# EAGLE design Pico_LED_Matrix_A1 (EAGLE 9.0.1)
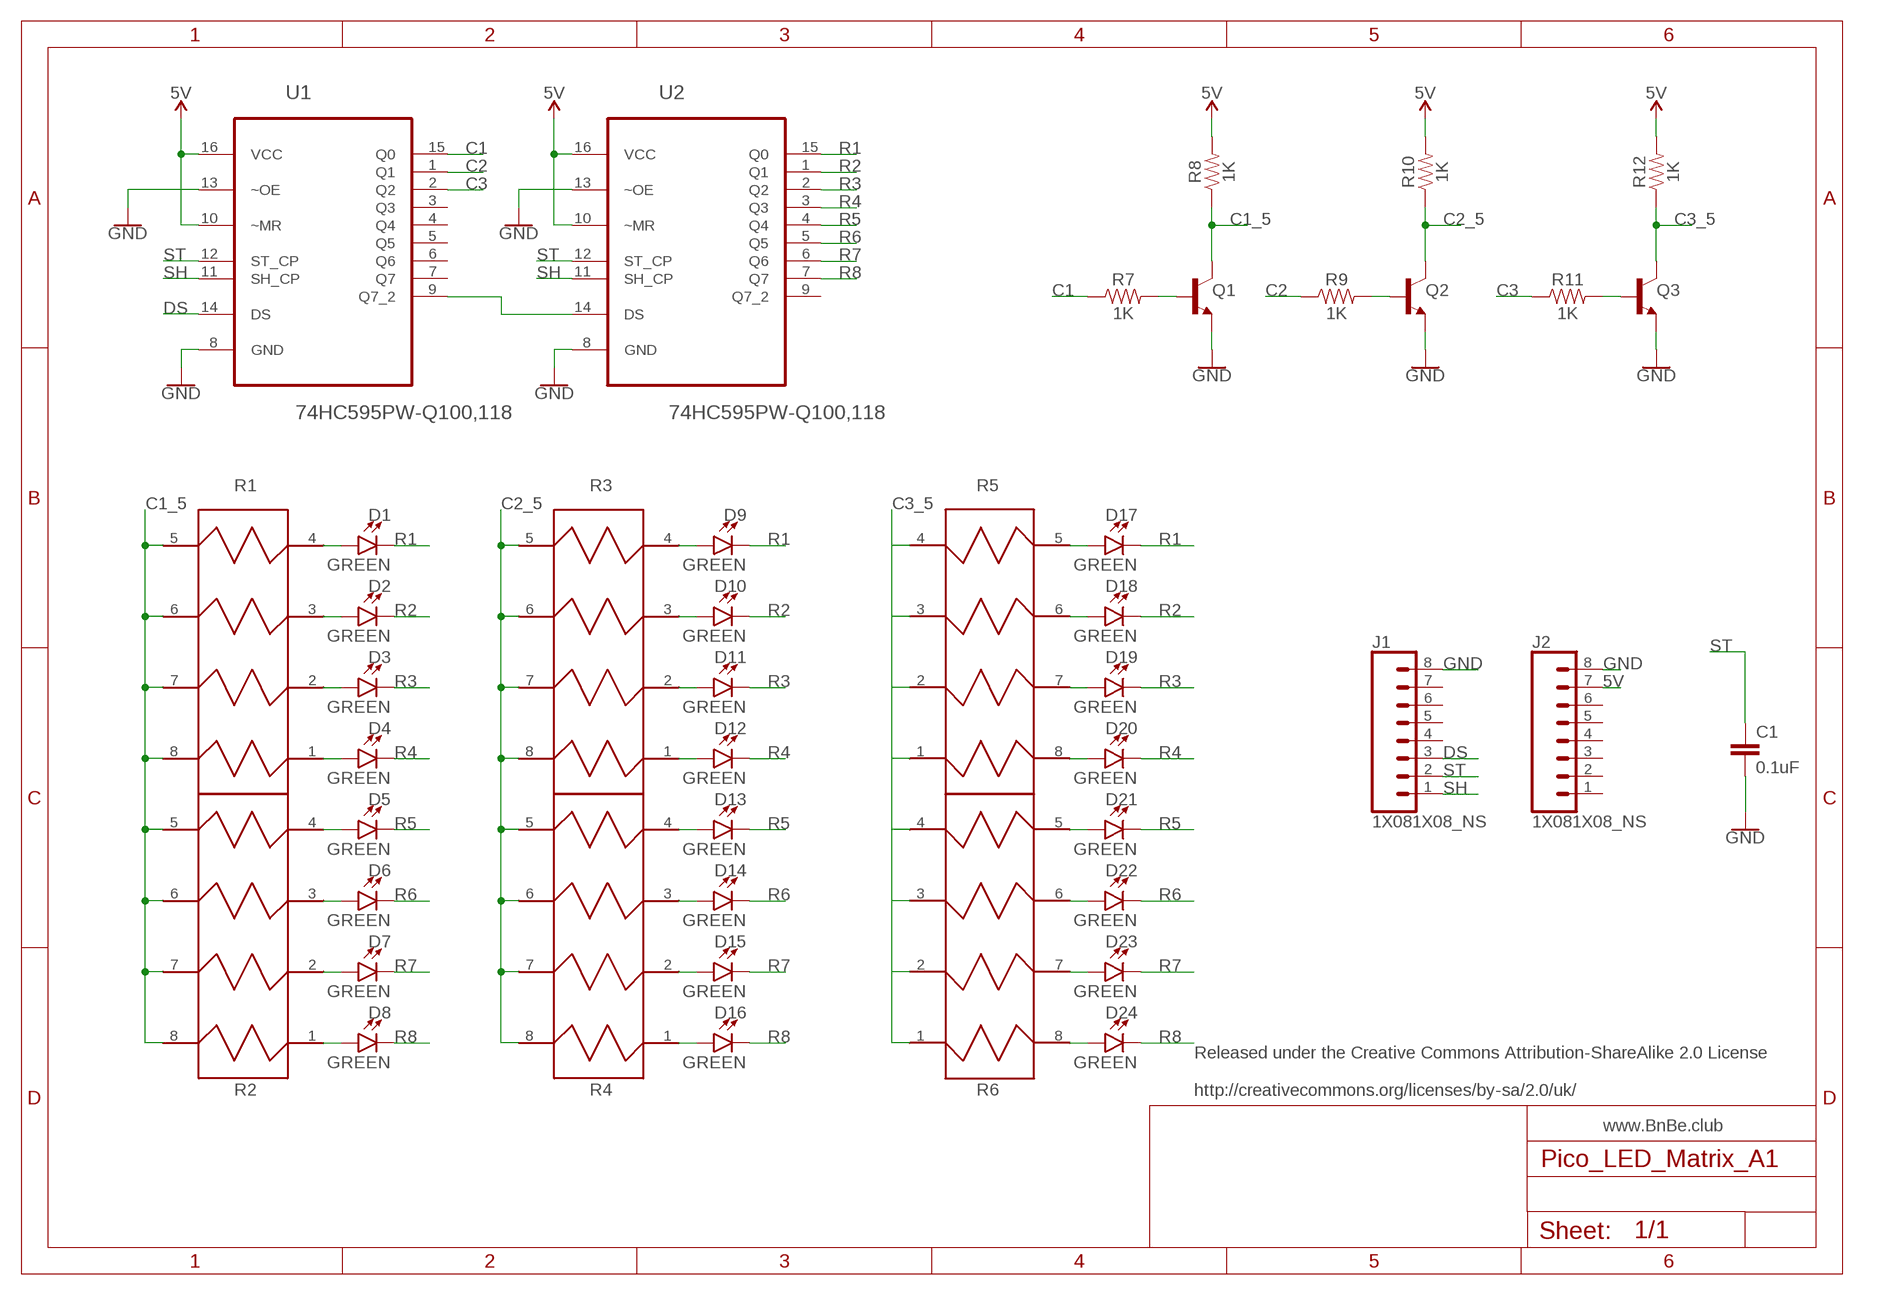
[diagram p0: schematic, sheet 1]

## Parts
C1  0.1uF  0.1UF-0402-16V-10%  [0402]
D1  GREEN  LED-GREEN0603  [LED-0603]
D2  GREEN  LED-GREEN0603  [LED-0603]
D3  GREEN  LED-GREEN0603  [LED-0603]
D4  GREEN  LED-GREEN0603  [LED-0603]
D5  GREEN  LED-GREEN0603  [LED-0603]
D6  GREEN  LED-GREEN0603  [LED-0603]
D7  GREEN  LED-GREEN0603  [LED-0603]
D8  GREEN  LED-GREEN0603  [LED-0603]
D9  GREEN  LED-GREEN0603  [LED-0603]
D10  GREEN  LED-GREEN0603  [LED-0603]
D11  GREEN  LED-GREEN0603  [LED-0603]
D12  GREEN  LED-GREEN0603  [LED-0603]
D13  GREEN  LED-GREEN0603  [LED-0603]
D14  GREEN  LED-GREEN0603  [LED-0603]
D15  GREEN  LED-GREEN0603  [LED-0603]
D16  GREEN  LED-GREEN0603  [LED-0603]
D17  GREEN  LED-GREEN0603  [LED-0603]
D18  GREEN  LED-GREEN0603  [LED-0603]
D19  GREEN  LED-GREEN0603  [LED-0603]
D20  GREEN  LED-GREEN0603  [LED-0603]
D21  GREEN  LED-GREEN0603  [LED-0603]
D22  GREEN  LED-GREEN0603  [LED-0603]
D23  GREEN  LED-GREEN0603  [LED-0603]
D24  GREEN  LED-GREEN0603  [LED-0603]
J1  1X081X08_NS  [1X08_NS]
J2  1X081X08_NS  [1X08_NS]
Q1  TRANS_NPN-MMBT2222AL  [SOT23-3]
Q2  TRANS_NPN-MMBT2222AL  [SOT23-3]
Q3  TRANS_NPN-MMBT2222AL  [SOT23-3]
R1  EXBN8V220JX  [RESCAV50P200X100X55-8N]
R2  EXBN8V220JX  [RESCAV50P200X100X55-8N]
R3  EXBN8V220JX  [RESCAV50P200X100X55-8N]
R4  EXBN8V220JX  [RESCAV50P200X100X55-8N]
R5  EXBN8V220JX  [RESCAV50P200X100X55-8N]
R6  EXBN8V220JX  [RESCAV50P200X100X55-8N]
R7  1K  RESISTOR0402  [0402]
R8  1K  RESISTOR0402  [0402]
R9  1K  RESISTOR0402  [0402]
R10  1K  RESISTOR0402  [0402]
R11  1K  RESISTOR0402  [0402]
R12  1K  RESISTOR0402  [0402]
U1  74HC595PW-Q100,118  [SOP65P640X110-16N]
U2  74HC595PW-Q100,118  [SOP65P640X110-16N]

## Nets
5V: J2.7 R8.2 R10.2 R12.2 U1.10(~MR) U1.16(VCC) U2.10(~MR) U2.16(VCC)
C1: R7.1 U1.15(Q0)
C1_5: Q1.3(C) R1.5 R1.6 R1.7 R1.8 R2.5 R2.6 R2.7 R2.8 R8.1
C2: R9.1 U1.1(Q1)
C2_5: Q2.3(C) R3.5 R3.6 R3.7 R3.8 R4.5 R4.6 R4.7 R4.8 R10.1
C3: R11.1 U1.2(Q2)
C3_5: Q3.3(C) R5.1 R5.2 R5.3 R5.4 R6.1 R6.2 R6.3 R6.4 R12.1
DS: J1.3 U1.14(DS)
GND: C1.2 J1.8 J2.8 Q1.2(E) Q2.2(E) Q3.2(E) U1.8(GND) U1.13(~OE) U2.8(GND) U2.13(~OE)
N$1: D2.A R1.3
N$2: D3.A R1.2
N$3: D4.A R1.1
N$4: D5.A R2.4
N$5: D6.A R2.3
N$6: D7.A R2.2
N$7: D8.A R2.1
N$8: D9.A R3.4
N$9: D10.A R3.3
N$10: D11.A R3.2
N$11: D12.A R3.1
N$12: D13.A R4.4
N$13: D14.A R4.3
N$14: D15.A R4.2
N$15: D16.A R4.1
N$16: D17.A R5.5
N$17: D18.A R5.6
N$18: D19.A R5.7
N$19: D20.A R5.8
N$20: D21.A R6.5
N$21: D22.A R6.6
N$22: D23.A R6.7
N$23: D24.A R6.8
N$24: D1.A R1.4
N$25: U1.9(Q7_2) U2.14(DS)
N$27: Q1.1(B) R7.2
N$28: Q2.1(B) R9.2
N$29: Q3.1(B) R11.2
R1: D1.C D9.C D17.C U2.15(Q0)
R2: D2.C D10.C D18.C U2.1(Q1)
R3: D3.C D11.C D19.C U2.2(Q2)
R4: D4.C D12.C D20.C U2.3(Q3)
R5: D5.C D13.C D21.C U2.4(Q4)
R6: D6.C D14.C D22.C U2.5(Q5)
R7: D7.C D15.C D23.C U2.6(Q6)
R8: D8.C D16.C D24.C U2.7(Q7)
SH: J1.1 U1.11(SH_CP) U2.11(SH_CP)
ST: C1.1 J1.2 U1.12(ST_CP) U2.12(ST_CP)
Unconnected: J1.4 J1.5 J1.6 J1.7 J2.1 J2.2 J2.3 J2.4 J2.5 J2.6 U1.3(Q3) U1.4(Q4) U1.5(Q5) U1.6(Q6) U1.7(Q7) U2.9(Q7_2)

## Notes on the sheet
- Released under the Creative Commons Attribution-ShareAlike 2.0 License
  
  http://creativecommons.org/licenses/by-sa/2.0/uk/
- www.BnBe.club

## Library data of the parts
C1 = SparkFun-Capacitors:0.1UF: 0.1µF ceramic capacitors A capacitor is a passive two-terminal electrical component used to store electrical energy temporarily in an electric field.; PROD_ID: CAP-12416
D1-D24 = SparkFun-LED:LED-GREEN: Green SMD LED Used in manufacturing of various products at SparkFun Packages: 0603 - SMD 0603 package [Product Link] <http://www.futureelectronics.com/en/technologies/semiconductors/optoelectronics/leds/Pages/9894312-LTST-C190GKT.aspx?CrossPart=HSMG-C190&IM=0> LilyPad 1206 - SMD1206 LilyPad package [Product Link] <http://www.futureelectronics.com/en/Technologies/Product.aspx?ProductID=IN150NGHARVATEKCORPORATION2049943&IM=0> 1206 - SMD1206 package [Product Link] <http://www.futureelectronics.com/en/technologies/semiconductors/optoelectronics/leds/Pages/8315665-LTST-C150KGKT.aspx?IM=0> 1206 Bottom Mount -SMD 1206 Bottom Mount [Product Link] <http://www.digikey.com/product-detail/en/lite-on-inc/LTST-C230KGKT/160-1456-1-ND/386854> SparkFun Products: Pro Mini 328 -5V <https://www.sparkfun.com/products/821> RedBoard <https://www.sparkfun.com/products/12757> MP3 Trigger <https://www.sparkfun.com/products/13720> Makey Makey <https://www.sparkfun.com/products/11076>; PROD_ID: DIO-00821
J1 J2 = Frenoy_Custom:1X08
Q1-Q3 = SparkFun-DiscreteSemi:TRANS_NPN: NPN transistor Current controlled devices typically used to amplify current or used as a switch. BC547 - COM-08928 <http://www.sparkfun.com/products/8928> (TO-92 45V 100mA) (1.Collector 2.Base 3.Emitter) 2N3904 - COM-00521 <http://www.sparkfun.com/products/521> (TO-92 40V 200mA) (1.Emitter 2.Base 3.Collector) P2N2222A - COM-12852 <http://www.sparkfun.com/products/12852> (TO-92 40V 600mA) (1.Collector 2.Base 3.Emitter); PROD_ID: TRANS-08049; VALUE: 600mA/40V
R1-R6 = Res-Array_0402x4:EXBN8V220JX: Res Thick Film Array 1K Ohm 5% ±200ppm/°C ISOL Molded 8-Pin 0804(4 X 0402) Concave SMD Punched Carrier T/R; AVAILABILITY: Good; DESCRIPTION: Res Thick Film Array 22 Ohm 5% Â±200ppm/Â°C ISOL Molded 8-Pin 0804_4 X 0402_ Concave SMD T/R; MF: Panasonic Electronic; MP: EXB-N8V220JX; PACKAGE: 0804 Panasonic; PRICE: 0.02 USD
R7-R12 = SparkFun-Resistors:RESISTOR: Generic Resistor Package
U1 U2 = 74HC595PW-Q100_118:74HC595PW-Q100,118: shift register with output latches; AVAILABILITY: Good; DESCRIPTION: 74HC_T_595-Q100 - 8-bit serial-in, serial or parallel-out shift register with output latches; 3-state; MF: Nexperia; MP: 74HC595PW-Q100,118; PACKAGE: TSSOP-16 Nexperia; PRICE: 0.20 USD

## Board
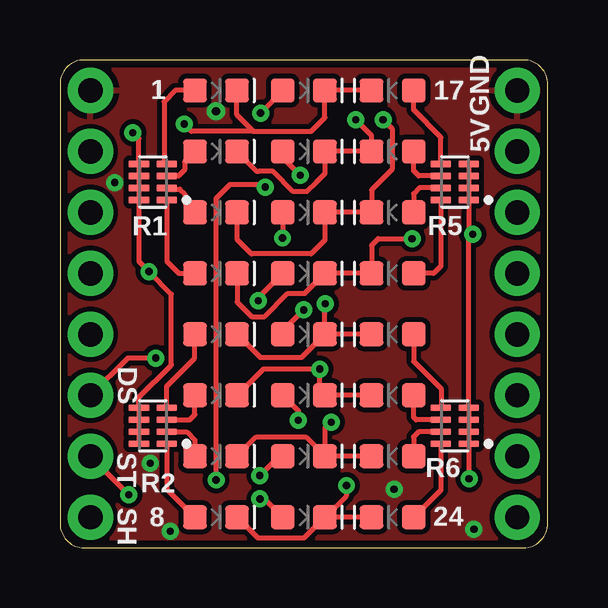
[diagram p1: board, top side]
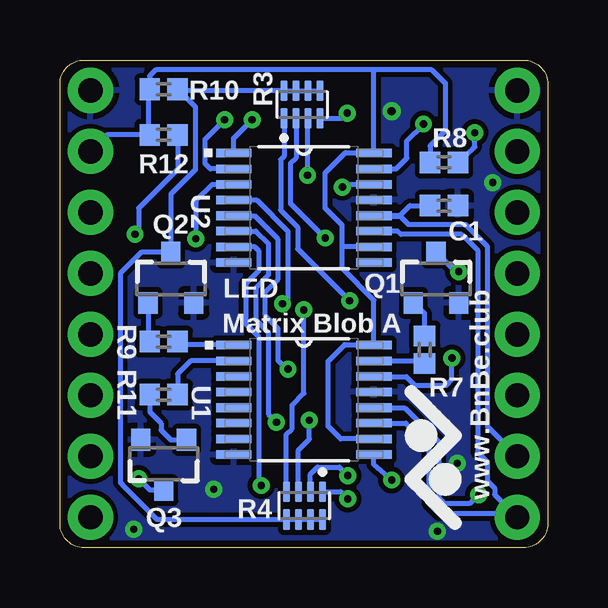
[diagram p2: board, bottom side, seen from below]

Size 20.32 x 20.32 mm. Coordinates in mm from the lower left corner, seen from the top.
Outline: 0,19.32 0,1 arc90 1,0 19.32,0 arc90 20.32,1 20.32,19.32 arc90 19.32,20.32 1,20.32 arc90 0,19.32
Copper layers (1*16): Top 0.035mm / dielectric 1.5mm / Bottom 0.035mm
Design rules "JLPCB_2L_Recommended_Use_this": minimum track width 8mil, minimum drill 0.3mm, track to track 8mil, track to pad 8mil, pad to pad 8mil, via to via 8mil, smd to smd 8mil, copper to edge 12mil, drill to drill 6mil, minimum pad ring 10mil, minimum via ring 8mil, stop-mask expansion 4mil, vias tented up to drill 20mil, thermal gap 10mil

### Footprints (pad centres in the part's own frame; a part is rotated, then mirrored left to right if it is on the bottom)
0402 = smd 0.85 x 0.9: 1 -0.58,0; 2 0.58,0
LED-0603 = smd 1 x 1: A -0.877,0; C 0.877,0
1X08_NS = drill 1.016 pad 1.88: 1 0,0; 2 2.54,0; 3 5.08,0; 4 7.62,0; 5 10.16,0; 6 12.7,0; 7 15.24,0; 8 17.78,0
SOT23-3 = smd 0.8 x 0.9: 1 -0.95,-1; 2 0.95,-1; 3 0,1.1
RESCAV50P200X100X55-8N = smd 0.87 x 0.29: 1 -0.58,0.75; 2 -0.58,0.25; 3 -0.58,-0.25; 4 -0.58,-0.75; 5 0.58,-0.75; 6 0.58,-0.25; 7 0.58,0.25; 8 0.58,0.75
SOP65P640X110-16N = smd 1.473 x 0.356: 1 -2.921,2.286; 2 -2.921,1.626; 3 -2.921,0.965; 4 -2.921,0.33; 5 -2.921,-0.33; 6 -2.921,-0.965; 7 -2.921,-1.626; 8 -2.921,-2.286; 9 2.921,-2.286; 10 2.921,-1.626; 11 2.921,-0.965; 12 2.921,-0.33; 13 2.921,0.33; 14 2.921,0.965; 15 2.921,1.626; 16 2.921,2.286

### Placement (x,y rotation side)
C1  4.32,14.25 0 bottom
D1  6.5,19.05 0 top
D2  6.5,16.51 0 top
D3  6.5,13.97 0 top
D4  6.5,11.43 0 top
D5  6.5,8.89 0 top
D6  6.5,6.35 0 top
D7  6.5,3.81 0 top
D8  6.5,1.27 0 top
D9  10.16,19.05 0 top
D10  10.16,16.51 0 top
D11  10.16,13.97 0 top
D12  10.16,11.43 0 top
D13  10.16,8.89 0 top
D14  10.16,6.35 0 top
D15  10.16,3.81 0 top
D16  10.16,1.27 0 top
D17  13.86,19.05 180 top
D18  13.86,16.51 180 top
D19  13.86,13.97 180 top
D20  13.86,11.43 180 top
D21  13.86,8.89 180 top
D22  13.86,6.35 180 top
D23  13.86,3.81 180 top
D24  13.86,1.27 180 top
J1  1.27,1.27 90 top
J2  19.05,1.27 90 top
Q1  4.65,11.2 0 bottom
Q2  15.7,11.2 0 bottom
Q3  16,3.5 180 bottom
R1  3.87,15.24 180 top
R2  3.87,5.08 180 top
R3  10.24,18.47 90 bottom
R4  10.13,1.75 270 bottom
R5  16.45,15.24 180 top
R6  16.45,5.08 180 top
R7  5.13,8.25 90 bottom
R8  4.32,16.05 180 bottom
R9  16,8.59 180 bottom
R10  16,19.1 180 bottom
R11  16,6.38 180 bottom
R12  16,17.2 180 bottom
U1  10.16,6.16 0 bottom
U2  10.16,14.16 0 bottom

### Tracks (layer width: path | path; a pad name or v marks a point on that pad's centre or on a via)
5V
  Bottom 0.203: 7.32,19.91 4.83,19.91 4.27,19.36 4.27,17.37 4.9,16.74 R8.2 | 7.32,19.91 16.33,19.91 16.59,19.66 16.58,19.65 R10.2 16.64,19.04 16.64,17.2 R12.2 18.36,17.2 J2.7 | U2.16 | U2.16 7.24,19.84 7.32,19.91 | 7.35,12.5 U2.10 8.55,12.53 8.56,12.55 | U1.10 8.62,4.53 9.14,5.05 9.14,7.77 8.46,8.46 7.25,8.46 U1.16 7.24,10.31 8.56,11.63 8.56,12.55 | U2.16 8.43,16.46 9.27,15.62 9.27,14.15 8.56,13.44 8.56,12.55
C1
  Bottom 0.203: U1.15 5.25,7.79 R7.1
C1_5  (via drill 0.3)
  Top 0.203: R2.8 R2.7 R2.6 R2.5 3.29,6.26 4.61,7.58 | 4.61,7.58 4.65,7.62 | 4.61,7.58 4.61,7.59 4.65,7.63 4.65,10.57 v3.71,11.51 3.29,11.93 R1.8 R1.7 R1.6 R1.5 3.29,17.04 v3.04,17.29
  Bottom 0.203: R8.1 3.12,16.62 3.04,16.7 v3.04,17.29 | Q1.3 3.83,11.51 v3.71,11.51
C2
  Bottom 0.203: U1.1 15.18,8.45 R9.1
C2_5
  Bottom 0.203: R3.5 R3.6 R3.7 R3.8 15.37,19.05 R10.1 14.68,18.36 14.68,15.75 15.7,14.73 Q2.3 16.93,12.3 17.8,11.43 17.8,2.72 17.7,2.61 17.7,2.6 16.28,1.17 R4.5 R4.6 R4.7 R4.8
C3
  Bottom 0.203: U1.2 14.87,7.79 15.42,7.24 R11.1
C3_5  (via drill 0.3)
  Top 0.203: R5.4 R5.3 R5.2 R5.1 17.03,13.22 v17.2,13.06 17.03,12.89 R6.4 R6.3 R6.2 R6.1 17.03,2.88 v17.04,2.87
  Bottom 0.203: Q3.3 16.57,2.4 v17.04,2.87 | R12.1 15.42,15.77 17.04,14.15 17.04,13.21 v17.2,13.06
DS  (via drill 0.3)
  Top 0.203: v3.99,7.9 2.82,7.9 J1.3
  Bottom 0.203: v3.99,7.9 3.99,7.01 4.24,6.76 5.52,6.76 5.89,7.12 U1.14
GND  (via drill 0.3, 0.35)
  other vias: 6.5,18.19 2.29,15.21 13.92,2.44 4.59,0.68 17.25,0.76 3.77,3.52
  pour Bottom (isolate 0.203): -0.18,20.62 20.32,20.55 20.32,-0.18 -0.18,0.08
  pour Top (isolate 0.203): 0.01,20.28 20.22,20.35 20.37,20.29 20.27,-0.3 0.01,-0.27
N$1
  Top 0.203: 5.64,16.49 D2.A 5.19,16.08 5.19,15.74 4.94,15.49 R1.3
N$2
  Top 0.203: R1.2 4.5,14.94 4.99,14.94 5.19,14.74 5.19,14.4 D3.A
N$3
  Top 0.203: R1.1 4.45,13.9 4.45,11.93 4.95,11.43 D4.A
N$4
  Top 0.203: D5.A 5.61,7.9 4.45,6.74 R2.4
N$5
  Top 0.203: R2.3 5.41,5.33 5.62,5.55 D6.A
N$6
  Top 0.203: R2.2 5.28,4.83 5.62,4.49 D7.A
N$7
  Top 0.203: R2.1 4.45,2.44 D8.A
N$8  (via drill 0.3)
  Top 0.203: D9.A 8.36,18.12 v8.36,18.11
  Bottom 0.203: R3.4 8.58,17.89 v8.36,18.11
N$9  (via drill 0.3)
  Top 0.203: 9.28,16.11 D10.A 9.28,16.24 v10.01,15.52
  Bottom 0.203: R3.3 10.01,17.86 v10.01,15.52
N$10  (via drill 0.3)
  Top 0.203: 9.28,13.68 D11.A 9.27,13.96 v9.27,12.9
  Bottom 0.203: R3.2 10.49,16.23 10.72,16 10.72,14.35 v9.27,12.9
N$11  (via drill 0.3)
  Top 0.203: D12.A 8.33,10.48 v8.26,10.29
  Bottom 0.203: R3.1 10.99,16.31 11.12,16.17 11.12,14.06 10.41,13.35 10.41,12.45 v8.26,10.29
N$12  (via drill 0.3)
  Top 0.203: v10.16,9.91 9.28,9.03 D13.A
  Bottom 0.203: 10.87,2.35 R4.4 10.88,4.72 10.64,4.96 10.64,5.94 10.16,6.43 v10.16,9.91
N$13  (via drill 0.3)
  Top 0.203: D14.A 9.93,5.7 v9.93,5.31
  Bottom 0.203: R4.3 10.38,4.07 9.93,4.52 v9.93,5.31
N$14  (via drill 0.3)
  Top 0.203: 9,3.98 D15.A 9.13,3.81 v8.33,3
  Bottom 0.203: R4.2 9.88,3.07 9.6,3.35 8.68,3.35 v8.33,3
N$15  (via drill 0.3)
  Top 0.203: v8.33,2.03 8.46,2.1 D16.A
  Bottom 0.203: R4.1 8.63,2.33 v8.33,2.03
N$16
  Top 0.203: R5.5 15.87,17.1 14.73,18.24 D17.A
N$17
  Top 0.203: R5.6 14.94,15.49 14.73,15.7 D18.A
N$18
  Top 0.203: R5.7 14.96,14.99 14.73,14.76 14.74,14.75 D19.A
N$19
  Top 0.203: R5.8 15.87,11.73 15.57,11.43 D20.A
N$20
  Top 0.203: D21.A 14.74,7.77 15.88,6.63 R6.5
N$21
  Top 0.203: R6.6 14.84,5.33 14.73,5.44 14.74,5.44 D22.A
N$22
  Top 0.203: R6.7 14.94,4.83 14.73,4.62 14.74,4.62 D23.A
N$23
  Top 0.203: R6.8 15.87,2.4 D24.A
N$24
  Top 0.203: D1.A 4.8,19.05 4.34,18.59 4.34,16.1 R1.4
N$25  (via drill 0.3)
  Top 0.203: 6.55,2.87 v6.5,2.82 6.5,14.55 7.09,15.14 8.44,15.14 v8.55,15.03
  Bottom 0.203: v6.5,2.82 7.24,3.45 U1.9 | U2.14 8.45,15.12 v8.55,15.03
N$27
  Bottom 0.203: R7.2 5.13,9.75 Q1.1
N$28
  Bottom 0.203: Q2.1 16.65,8.65 R9.2
N$29
  Bottom 0.203: R11.2 16.58,5.66 16.1,5.18 16.1,4.9 15.7,4.5 | 15.7,4.5 | 15.7,4.5 Q3.1
R1  (via drill 0.3)
  Top 0.203: D17.C 11.12,19.05 | 11.12,19.05 D9.C 11.04,17.92 10.46,17.35 8.05,17.35 | 7.38,19.26 D1.C 7.37,19.04 7.37,18.03 8.05,17.35 | 11.05,18.97 11.12,19.05 | 8.05,17.35 5.48,17.35 v5.17,17.65
  Bottom 0.203: U2.15 6.31,15.79 5.87,16.23 5.87,16.96 v5.17,17.65
R2  (via drill 0.3)
  Top 0.203: D10.C D18.C 12.98,17.17 v12.32,17.83 | D10.C 11.04,16.88 | D10.C 11.05,16.5 11.05,15.6 10.69,15.24 10.69,15.23 10.29,14.83 9.73,14.83 8.88,15.68 8.28,15.68 8.27,15.67 8.21,15.67 D2.C
  Bottom 0.203: U2.1 13.08,17.07 v12.32,17.83
R3  (via drill 0.3)
  Top 0.203: D19.C | D19.C D11.C 11.04,12.81 10.46,12.24 7.98,12.24 7.39,12.83 7.39,13.93 7.37,13.96 D3.C | v13.46,17.83 13.84,17.45 13.84,15.77 12.98,14.91 D19.C
  Bottom 0.203: U2.2 14.06,15.79 14.28,16 14.28,17.02 v13.46,17.83
R4  (via drill 0.3)
  Top 0.203: 7.16,11.22 D4.C 7.38,10.23 7.98,9.63 8.53,9.63 9.49,10.59 10.2,10.59 D12.C D20.C 12.98,12.6 13.26,12.88 v14.67,12.88
  Bottom 0.203: U2.3 13.98,15.12 14.68,14.43 14.67,14.42 v14.67,12.88
R5  (via drill 0.3)
  Top 0.203: D21.C D13.C | D5.C 8.34,7.92 10.07,7.92 D13.C | D13.C 11.04,10.15 v11.05,10.16
  Bottom 0.203: U2.4 12.13,14.49 10.82,13.18 10.82,10.39 v11.05,10.16
R6  (via drill 0.3)
  Top 0.203: D22.C D14.C 10.82,6.57 v10.82,7.44 8.47,7.44 D6.C
  Bottom 0.203: U2.5 12.21,13.83 11.23,12.84 11.23,11.2 11.76,10.66 11.76,9.66 11.23,9.12 11.23,7.8 10.87,7.44 v10.82,7.44
R7  (via drill 0.3)
  Top 0.203: D23.C D15.C | 10.9,3.95 D15.C | D7.C 8.18,4.62 10.23,4.62 D15.C | v11.3,5.23 11.04,5.02 D15.C
  Bottom 0.203: U2.6 12.15,13.2 11.63,12.68 11.63,11.36 12.17,10.83 12.17,9.49 11.63,8.96 11.63,5.56 v11.3,5.23
R8  (via drill 0.3)
  Top 0.203: D24.C D16.C | 7.38,1.31 D8.C 8.24,0.41 10.17,0.41 D16.C | D16.C 11.94,2.17 v11.94,2.59
  Bottom 0.203: v11.94,2.59 12.04,2.69 12.04,8.79 12.57,9.32 12.57,11 12.04,11.53 12.04,12.37 12.2,12.53 U2.7
SH
  Bottom 0.203: U2.11 6.26,13.2 6.12,13.06 3.59,13.06 2.92,12.39 2.92,3.98 2.52,3.58 2.52,2.79 2.21,2.48 2.21,2.21 1.42,1.42 | U1.11 5.91,5.2 4.95,4.24 4.95,1.85 4.52,1.42 1.42,1.42 | J1.1 1.42,1.42
ST  (via drill 0.3)
  Top 0.203: v2.87,2.21 J1.2
  Bottom 0.203: v2.87,2.21 3.23,1.85 4.32,1.85 4.55,2.08 4.55,4.42 5.96,5.83 U1.12 | C1.1 5.74,14.25 6.16,13.83 5.79,13.46 3.42,13.46 2.52,12.55 2.52,5.05 J1.2
  Bottom 0.254: U2.12 6.16,13.83

### Text on the board
tPlace: 1 | 17 | 8 | 24
bPlace: . | www.BnBe.club | LED | Matrix Blob A | .
tNames: GND | 5V | DS | ST | SH